# Altium schematic sheet SLAYER_ESP32_M1U.SchDoc
size Letter; SheetNumber: 1; SheetTotal: 4
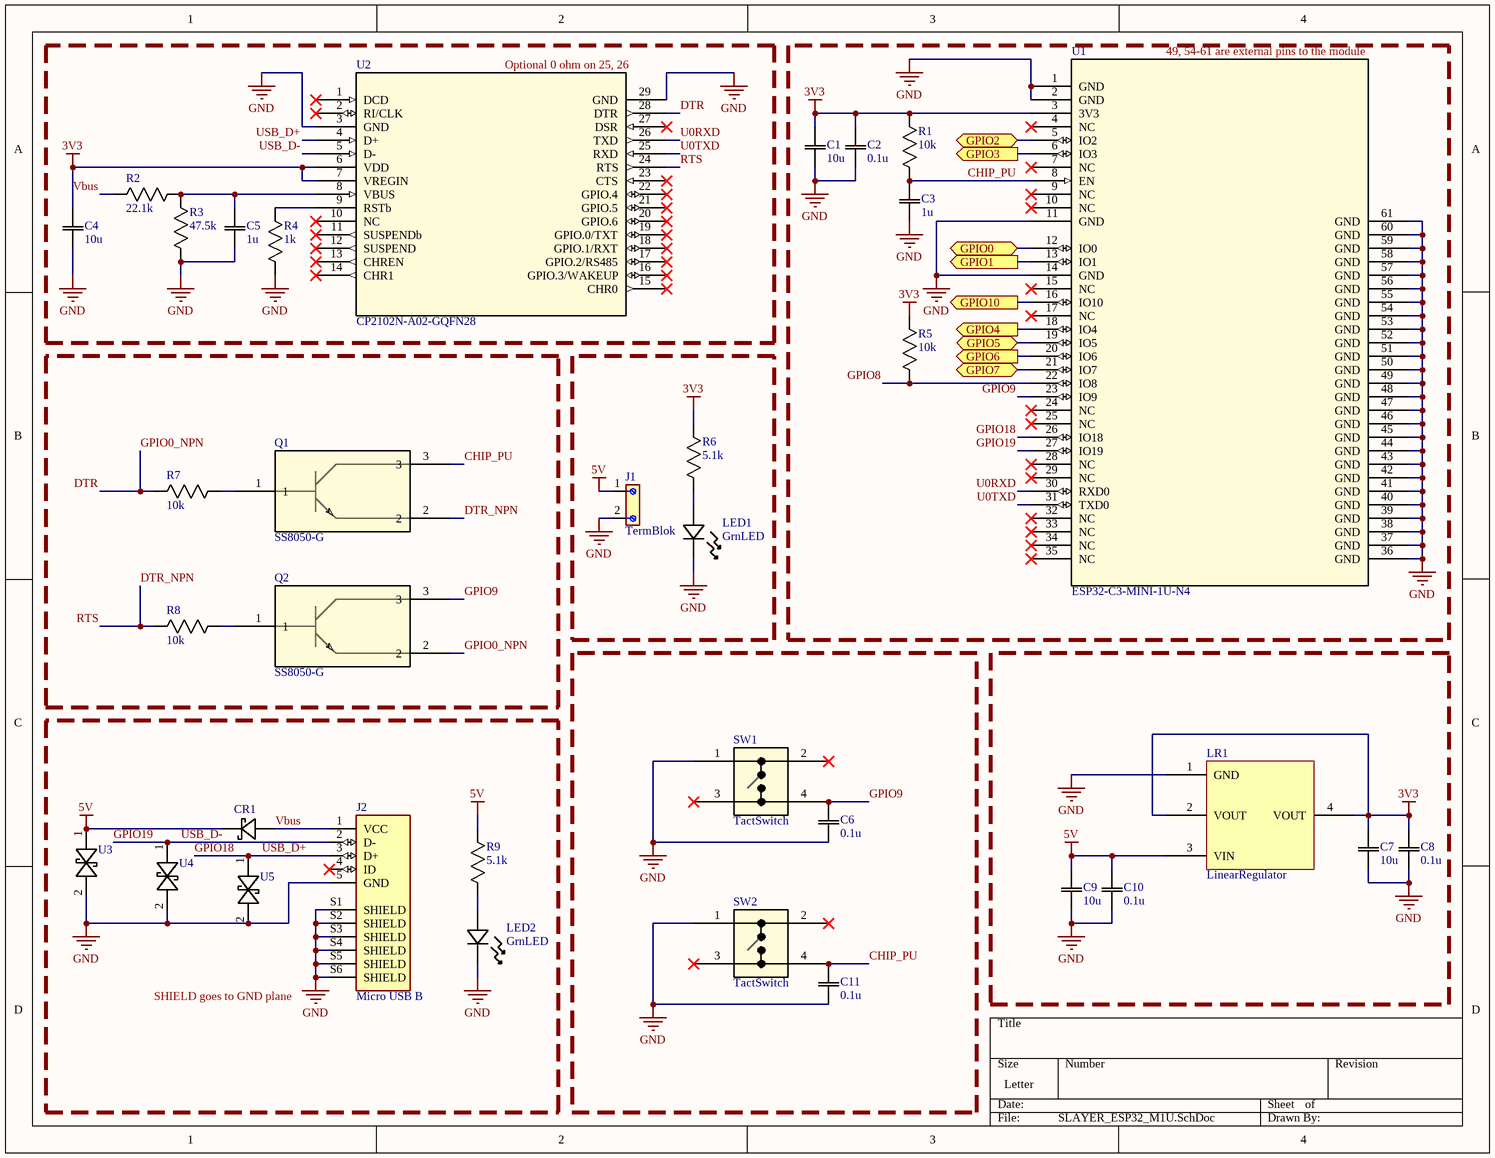
[diagram p0: SLAYER_ESP32_M1U.SchDoc]

## Parts
C1  10u  [10uF/25V/0603]
C2  0.1u  [0.1uF/50V]
C3  1u  [1uF/16V]
C4  10u  [10uF/25V/0603]
C5  1u  [1uF/16V]
C6  0.1u  [0.1uF/50V]
C7  10u  [10uF/25V/0603]
C8  0.1u  [0.1uF/50V]
C9  10u  [10uF/25V/0603]
C10  0.1u  [0.1uF/50V]
C11  0.1u  [0.1uF/50V]
CR1  B5819W-TP  [Schottky Diode]  (value not drawn)
J1  TermBlok  [TerminalBlock]
J2  Micro USB B  [Micro_USB_B]
LED1  GrnLED  [GreenLED]
LED2  GrnLED  [GreenLED]
LR1  LinearRegulator  [LinearRegulator]
Q1  SS8050-G  [NPN/25V/1.5A]
Q2  SS8050-G  [NPN/25V/1.5A]
R1  10k  [10k/0.125W]
R2  22.1k  [22.1k/0.125W]
R3  47.5k  [47.5k/0.125W]
R4  1k  [1k/0.125W]
R5  10k  [10k/0.125W]
R6  5.1k  [5.1k/0.25W]
R7  10k  [10k/0.125W]
R8  10k  [10k/0.125W]
R9  5.1k  [5.1k/0.25W]
SW1  TactSwitch  [TactSwitch]
SW2  TactSwitch  [TactSwitch]
U1  ESP32-C3-MINI-1U-N4  [ESP32-C3-MINI-1U_EXP]
U2  CP2102N-A02-GQFN28  [USB to UART]
U3  ESD5B5.0ST1G  [TVS Diode]  (value not drawn)
U4  ESD5B5.0ST1G  [TVS Diode]  (value not drawn)
U5  ESD5B5.0ST1G  [TVS Diode]  (value not drawn)

## Blocks framed on the sheet
Optional 0 ohm on 25, 26: C4 C5 R2-R4 U2
49, 54-61 are external pins to the module: C1-C3 R1 R5 U1
SHIELD goes to GND plane: CR1 J2 LED2 R9 U3-U5

## Ports
GPIO0 (bidir, see SLAYER_Sensors[1C]), GPIO1 (out, see SLAYER_Sensors[1C]), GPIO2 (bidir, see SLAYER_Storage[1A]), GPIO3 (out, see SLAYER_PyroActuation[1B]), GPIO4 (out, see SLAYER_Sensors[1A]), GPIO5 (bidir, see SLAYER_Sensors[1A]), GPIO6 (out, see SLAYER_Storage[1A]), GPIO7 (bidir, see SLAYER_Storage[1A]), GPIO10 (out, see SLAYER_Storage[2A])

## Nets
3V3: C1.2 C2.2 C4.2 C7.2 C8.2 LR1.2(VOUT) LR1.4(VOUT) R1.1 R5.1 R6.1 U1.3(3V3) U2.6(VDD) U2.7(VREGIN)
5V: C9.2 C10.2 CR1.1 J1.1 LR1.3(VIN) R9.1 U3.1
GND: C1.1 C2.1 C3.1 C4.1 C5.1 C6.1 C7.1 C8.1 C9.1 C10.1 C11.1 J1.2 J2.5(GND) J2.S1(SHIELD) J2.S2(SHIELD) J2.S3(SHIELD) J2.S4(SHIELD) J2.S5(SHIELD) J2.S6(SHIELD) LED1.1 LED2.1 LR1.1(GND) R3.2 R4.2 SW1.1 SW2.1 U1.1(GND) U1.2(GND) U1.11(GND) U1.14(GND) U1.36(GND) U1.37(GND) U1.38(GND) U1.39(GND) U1.40(GND) U1.41(GND) U1.42(GND) U1.43(GND) U1.44(GND) U1.45(GND) U1.46(GND) U1.47(GND) U1.48(GND) U1.49(GND) U1.50(GND) U1.51(GND) U1.52(GND) U1.53(GND) U1.54(GND) U1.55(GND) U1.56(GND) U1.57(GND) U1.58(GND) U1.59(GND) U1.60(GND) U1.61(GND) U2.3(GND) U2.29(GND) U3.2 U4.2 U5.2
CHIP_PU: C3.2 C11.2 Q1.3 R1.2 SW2.4 U1.8(EN)
DTR: Q2.2 R7.2 U2.28(DTR)  [also labelled GPIO0_NPN]
DTR_NPN: Q1.2 R8.2 U2.24(RTS)  [also labelled RTS]
GPIO0: U1.12(IO0) ; port GPIO0
GPIO1: U1.13(IO1) ; port GPIO1
GPIO2: U1.5(IO2) ; port GPIO2
GPIO3: U1.6(IO3) ; port GPIO3
GPIO4: U1.18(IO4) ; port GPIO4
GPIO5: U1.19(IO5) ; port GPIO5
GPIO6: U1.20(IO6) ; port GPIO6
GPIO7: U1.21(IO7) ; port GPIO7
GPIO8: R5.2 U1.22(IO8)
GPIO9: C6.2 Q2.3 SW1.4 U1.23(IO9)
GPIO10: U1.16(IO10) ; port GPIO10
GPIO18: J2.3(D+) U1.26(IO18) U2.4(D+) U5.1  [also labelled USB_D+]
GPIO19: J2.2(D-) U1.27(IO19) U2.5(D-) U4.1  [also labelled USB_D-]
U0RXD: U1.30(RXD0) U2.26(TXD)
U0TXD: U1.31(TXD0) U2.25(RXD)
Vbus: CR1.2 J2.1(VCC) R2.2
NetC5_2: C5.2 R2.1 R3.1 U2.8(VBUS)
NetLED1_2: LED1.2 R6.2
NetLED2_2: LED2.2 R9.2
NetQ1_1: Q1.1 R7.1
NetQ2_1: Q2.1 R8.1
NetR4_1: R4.1 U2.9(RSTb)

Not connected (* = marked no-connect by the designer): J2 4(ID)*; SW1 2* 3*; SW2 2* 3*; U1 4(NC)* 7(NC)* 9(NC)* 10(NC)* 15(NC)* 17(NC)* 24(NC)* 25(NC)* 28(NC)* 29(NC)* 32(NC)* 33(NC)* 34(NC)* 35(NC)*; U2 1(DCD)* 2(RI/CLK)* 10(NC)* 11(SUSPENDb)* 12(SUSPEND)* 13(CHREN)* 14(CHR1)* 15(CHR0)* 16(GPIO.3/WAKEUP)* 17(GPIO.2/RS485)* 18(GPIO.1/RXT)* 19(GPIO.0/TXT)* 20(GPIO.6)* 21(GPIO.5)* 22(GPIO.4)* 23(CTS)* 27(DSR)*

## Library data of the parts
C1 C4 C7 C9 = 10uF/25V: GRM188R61E106KA73D; Manufacturer_Name: Murata; Copyright: Copyright (C) 2026 Ultra Librarian. All rights reserved.; Manufacturer_Part_Number: GRM188R61E106KA73D
C2 C6 C8 C10 C11 = 0.1uF/50V: CC0603KRX7R9BB104; Manufacturer_Name: Yageo; Copyright: Copyright (C) 2025 Ultra Librarian. All rights reserved.; Manufacturer_Part_Number: CC0603KRX7R9BB104
C3 C5 = 1uF/16V: CL10B105KO8NNNC; Manufacturer_Name: Samsung; Copyright: Copyright (C) 2025 Ultra Librarian. All rights reserved.; Manufacturer_Part_Number: CL10B105KO8NNNC
CR1 = Schottky Diode: Manufacturer_Name: MCC; Copyright: Copyright (C) 2025 Ultra Librarian. All rights reserved.; Manufacturer_Part_Number: B5819W-TP
J1 = 2TerminalBlock: 691137710002; MF: WÃ¼rth Elektronik; SnapEDA_Link: https://www.snapeda.com/parts/691137710002/W%25C3%25BCrth+Elektronik+Midcom/view-part/?ref=snap; Package: None; Value: *; MP: 691137710002; Check_prices: https://www.snapeda.com/parts/691137710002/W%25C3%25BCrth+Elektronik+Midcom/view-part/?ref=eda
J2 = Micro USB B: 10118192-0002LF; MF: Amphenol ICC; SnapEDA_Link: https://www.snapeda.com/parts/10118192-0002LF/Amphenol+FCI/view-part/?ref=snap; Package: None; Value: *; MP: 10118192-0002LF; Check_prices: https://www.snapeda.com/parts/10118192-0002LF/Amphenol+FCI/view-part/?ref=eda
LED1 LED2 = GreenLED: LTST-C190KGKT; Manufacturer_Name: LITE-ON; Copyright: Copyright (C) 2025 Ultra Librarian. All rights reserved.; Manufacturer_Part_Number: LTST-C190KGKT
LR1 = LinearRegulator: SGM2212-3.3XKC3G/TR
Q1 Q2 = NPN/25V/1.5A: Manufacturer_Name: Comchip; Copyright: Copyright (C) 2026 Ultra Librarian. All rights reserved.; Manufacturer_Part_Number: SS8050-G; RefDes: RefDes; Type: Type
R1 R5 R7 R8 = 10k/0.125W: CRCW060310K0FKEA; Manufacturer_Name: Vishay; Copyright: Copyright (C) 2025 Ultra Librarian. All rights reserved.; Manufacturer_Part_Number: CRCW060310K0FKEA
R2 = 22.1k/0.125W: CRCW060322K1FKEA; Manufacturer_Name: Vishay; Copyright: Copyright (C) 2025 Ultra Librarian. All rights reserved.; Manufacturer_Part_Number: CRCW060322K1FKEA
R3 = 47.5k/0.125W: CRCW060347K5FKEA; Manufacturer_Name: Vishay; Copyright: Copyright (C) 2026 Ultra Librarian. All rights reserved.; Manufacturer_Part_Number: CRCW060347K5FKEA
R4 = 1k/0.125W: CRCW06031K00FKEA; Manufacturer_Name: Vishay; Copyright: Copyright (C) 2026 Ultra Librarian. All rights reserved.; Manufacturer_Part_Number: CRCW06031K00FKEA
R6 R9 = 5.1k/0.25W: CRCW08055K10FKEA; Manufacturer_Name: Vishay; Copyright: Copyright (C) 2026 Ultra Librarian. All rights reserved.; Manufacturer_Part_Number: CRCW08055K10FKEA
SW1 SW2 = TactSwitch: PTS815 SJM 250 SMTR LFS; Manufacturer_Name: C&K Components; Copyright: Copyright (C) 2026 Ultra Librarian. All rights reserved.; Manufacturer_Part_Number: PTS815 SJM 250 SMTR LFS; RefDes: RefDes; Type: Type
U1 = ESP32-C3-MINI-1U-N4: Description; Manufacturer_Name: Espressif Systems; Type: RF; Copyright: Copyright (C) 2025 Ultra Librarian. All rights reserved.; Manufacturer_Part_Number: ESP32-C3-MINI-1U-N4; RefDes: RefDes
U2 = USB to UART: Manufacturer_Name: Silicon Labs; Copyright: Copyright (C) 2025 Ultra Librarian. All rights reserved.; Manufacturer_Part_Number: CP2102N-A02-GQFN28; RefDes: RefDes; Type: Type
U3-U5 = TVS Diode: Manufacturer_Name: onsemi; Copyright: Copyright (C) 2025 Ultra Librarian. All rights reserved.; Manufacturer_Part_Number: ESD5B5.0ST1G; RefDes: RefDes; Type: Type